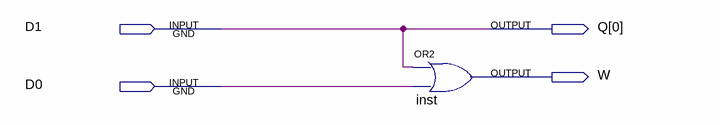
[diagram p0: schematic sheet]
// Quartus schematic CD2.bdf as structural Verilog: 1 symbols, 4 pins
module CD2 (
  input  D1,
  input  D0,
  output [0:0] Q,
  output W
);

  or inst (W, D1, D0);

  assign Q[0] = D1;
endmodule
